# Altium schematic sheet ColdBlock_PID_LCD00.SchDoc
size A4
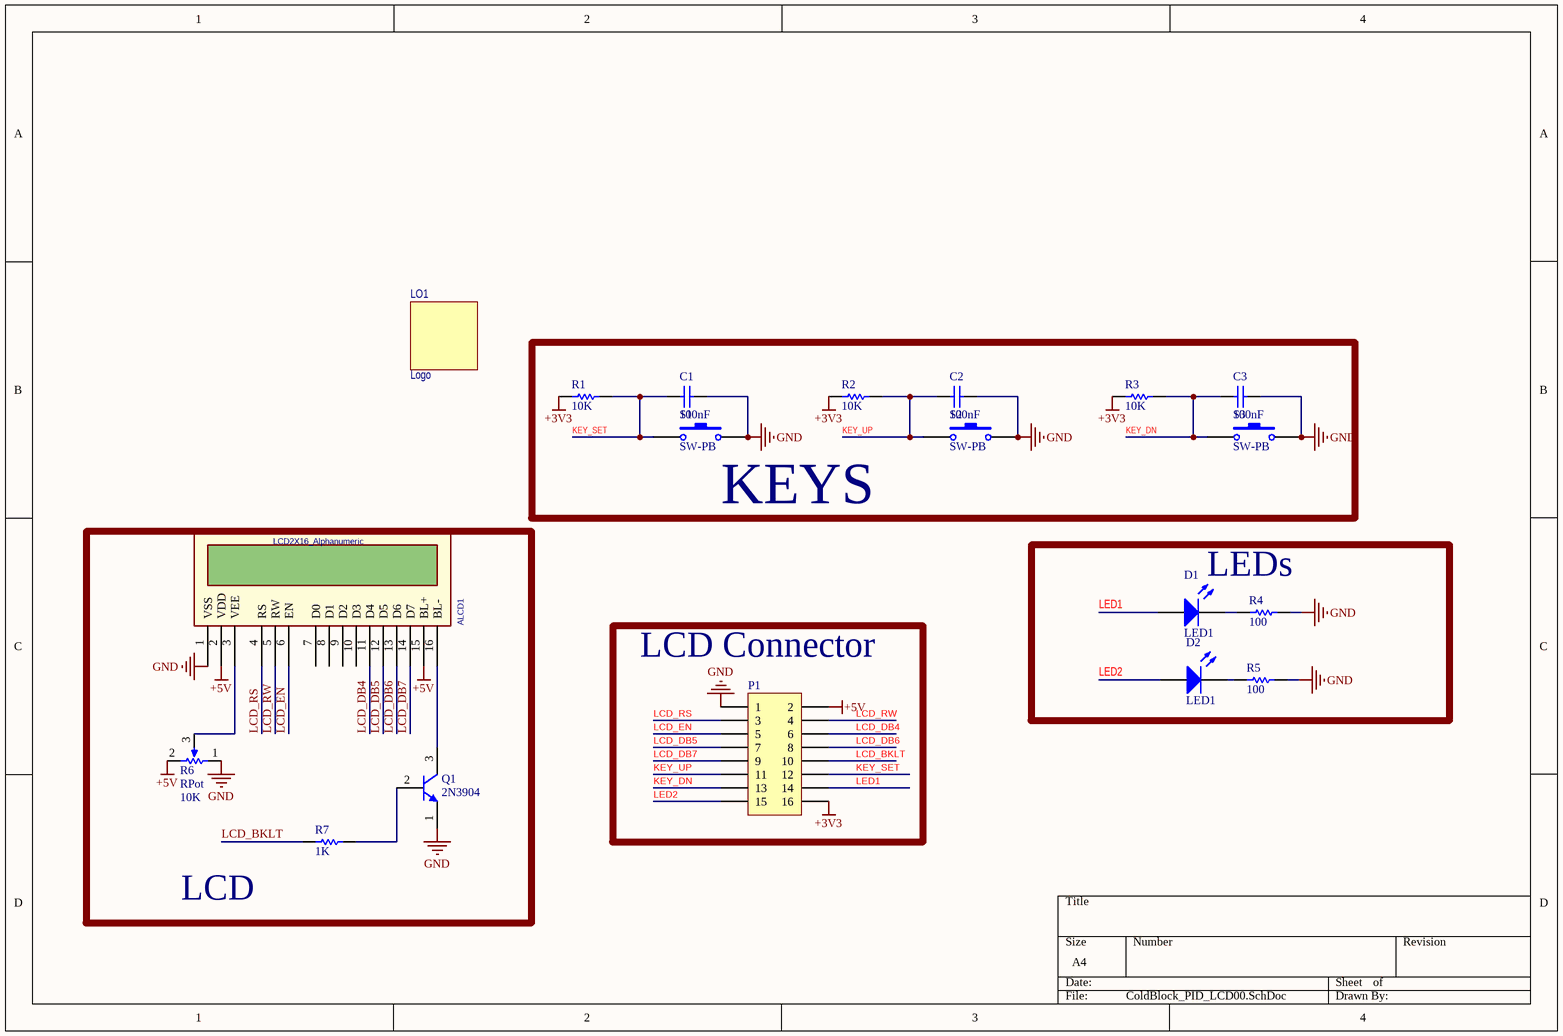
[diagram p0: ColdBlock_PID_LCD00.SchDoc]

## Parts
ALCD1  LCD2X16_Alphanumeric  [LCD_2X16 GREEN - 2.5mm]
C1  value 100nF  [CAP_MLCC_RAD_0.1]  (hidden comment: Cap)
C2  value 100nF  [CAP_MLCC_RAD_0.1]  (hidden comment: Cap)
C3  value 100nF  [CAP_MLCC_RAD_0.1]  (hidden comment: Cap)
D1  LED1  [LED5MM_BLUE]
D2  LED1  [LED5MM_BLUE]
LO1  Logo  [LOGO_PARS_TOP]
P1  Header 8X2  [IDC2.54_16PIN]  (value not drawn)
Q1  2N3904  [TO-92 STR]
R1  value 10K  [Axial 0_25 W, 0_4 IN LEAD PITCH]  (hidden comment: Res1)
R2  value 10K  [Axial 0_25 W, 0_4 IN LEAD PITCH]  (hidden comment: Res1)
R3  value 10K  [Axial 0_25 W, 0_4 IN LEAD PITCH]  (hidden comment: Res1)
R4  value 100  [Axial 0_25 W, 0_4 IN LEAD PITCH]  (hidden comment: Res1)
R5  value 100  [Axial 0_25 W, 0_4 IN LEAD PITCH]  (hidden comment: Res1)
R6  RPot  value 10K  [Potentiometer_EVND8]
R7  value 1K  [Axial 0_25 W, 0_4 IN LEAD PITCH]  (hidden comment: Res1)
S1  SW-PB  [SW-4PIN]
S2  SW-PB  [SW-4PIN]
S3  SW-PB  [SW-4PIN]

## Blocks framed on the sheet
KEYS: C1-C3 R1-R3 S1-S3
LCD: ALCD1 Q1 R6 R7
LEDs: D1 D2 R4 R5
LCD Connector: P1

## Nets
+3V3: P1.16 R1.2 R2.2 R3.2
+5V: ALCD1.2(VDD) ALCD1.15(BL+) P1.2 R6.2(BOT)
GND: ALCD1.1(VSS) C1.2 C2.2 C3.2 P1.1 Q1.1(E) R4.1 R5.1 R6.1(TOP) S1.2 S2.2 S3.2
KEY_DN: C3.1 P1.13 R3.1 S3.1
KEY_SET: C1.1 P1.12 R1.1 S1.1
KEY_UP: C2.1 P1.11 R2.1 S2.1
LCD_BKLT: P1.10 R7.2
LCD_DB4: ALCD1.11(D4) P1.6
LCD_DB5: ALCD1.12(D5) P1.7
LCD_DB6: ALCD1.13(D6) P1.8
LCD_DB7: ALCD1.14(D7) P1.9
LCD_EN: ALCD1.6(EN) P1.5
LCD_RS: ALCD1.4(RS) P1.3
LCD_RW: ALCD1.5(RW) P1.4
LED1: D1.1(A) P1.14
LED2: D2.1(A) P1.15
NetALCD1_3: ALCD1.3(VEE) R6.3(TAP)
NetALCD1_16: ALCD1.16(BL-) Q1.3(C)
NetD1_2: D1.2(K) R4.2
NetD2_2: D2.2(K) R5.2
NetQ1_2: Q1.2(B) R7.1

Not connected (* = marked no-connect by the designer): ALCD1 7(D0) 8(D1) 9(D2) 10(D3)

## Library data of the parts
ALCD1 = LCD2X16_Alphanumeric: Designer: Abbas Basereh; Data: 16-12-2016; Link: *; Part.No: *
C1-C3 = Cap: Capacitor; Published: 8-Jun-2000; LatestRevisionDate: 17-Jul-2002; LatestRevisionNote: Re-released for DXP Platform.; PackageReference: RAD-0.3; Publisher: Altium Limited; PackageDescription: Radial Cap, Thru-Hole; 2 Leads; 0.3 in Pin Spacing
D1 D2 = LED1: Typical RED GaAs LED; Published: 8-Jun-2000; LatestRevisionDate: 08-Jul-2005; LatestRevisionNote: Mech Layer 1 removed.; PackageReference: LED-1; Publisher: Altium Limited; PackageDescription: LED; 2 Leads
P1 = Header 8X2: Header, 8-Pin, Dual row; LatestRevisionDate: 17-Jul-2002; LatestRevisionNote: Re-released for DXP Platform.; Publisher: Altium Limited
Q1 = 2N3904: NPN General Purpose Amplifier; Published: 8-Jun-2000; LatestRevisionDate: 15-Jan-2003; LatestRevisionNote: PCB Footprint 'BCY-W3/D4.7' replaced; DatasheetVersion: 1997; PackageVersion: Sep-1998; PackageReference: TO-92A; Publisher: Altium Limited; PackageDescription: TO, Flat Index; 3 In-Line, Axial Leads; Body Dia. 4.5mm; Leads 0.51 x 0.48 mm (max); ComponentLink1Description: Manufacturer Link; ComponentLink1URL: http://www.fairchildsemi.com/; ComponentLink2Description: Datasheet; ComponentLink2URL: http://www.fairchildsemi.com/ds/2N%2F2N3904.pdf
R1-R5 R7 = Res1: Resistor; Published: 8-Jun-2000; LatestRevisionDate: 17-Jul-2002; LatestRevisionNote: Re-released for DXP Platform.; PackageReference: AXIAL-0.3; Publisher: Altium Limited; PackageDescription: Axial Device, Thru-Hole; 2 Leads; 0.3 in Pin Spacing
R6 = RPot: Potentiometer; Sim Note: Enter the Resistance value and the set point into parameter fields.; Set Position: 0.5; Published: 8-Jun-2000; LatestRevisionDate: 17-Jul-2002; LatestRevisionNote: Re-released for DXP Platform.; PackageReference: VR5; Publisher: Altium Limited; PackageDescription: Variable Resistor, Thru-Hole; 3 Leads
S1-S3 = SW-PB: Switch; Published: 24-Mar-1999; LatestRevisionDate: 17-Jul-2002; LatestRevisionNote: Re-released for DXP Platform.; PackageReference: SPST-2; Publisher: Altium Limited; PackageDescription: Switch; 2 Leads